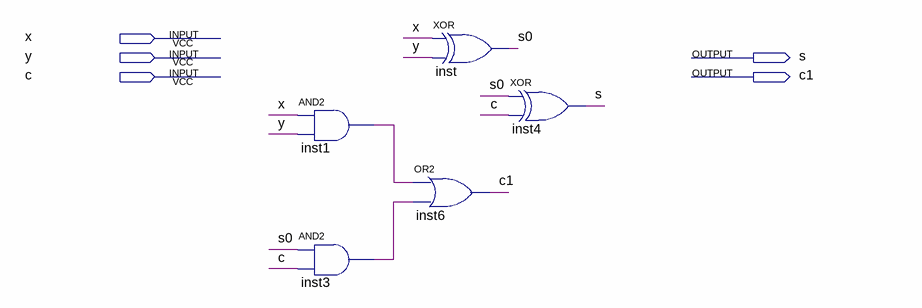
[diagram p0: schematic sheet]
// Quartus schematic aula5.bdf as structural Verilog: 5 symbols, 5 pins
module aula5 (
  input  x,
  input  y,
  input  c,
  output s,
  output c1
);

  wire inst1_out, inst3_out, s0;

  and inst1 (inst1_out, x, y);
  and inst3 (inst3_out, s0, c);
  or inst6 (c1, inst1_out, inst3_out);
  xor inst (s0, x, y);
  xor inst4 (s, s0, c);
endmodule
